# Altium schematic sheet MCU.SchDoc
size A3; SheetNumber: 1; SheetTotal: 3
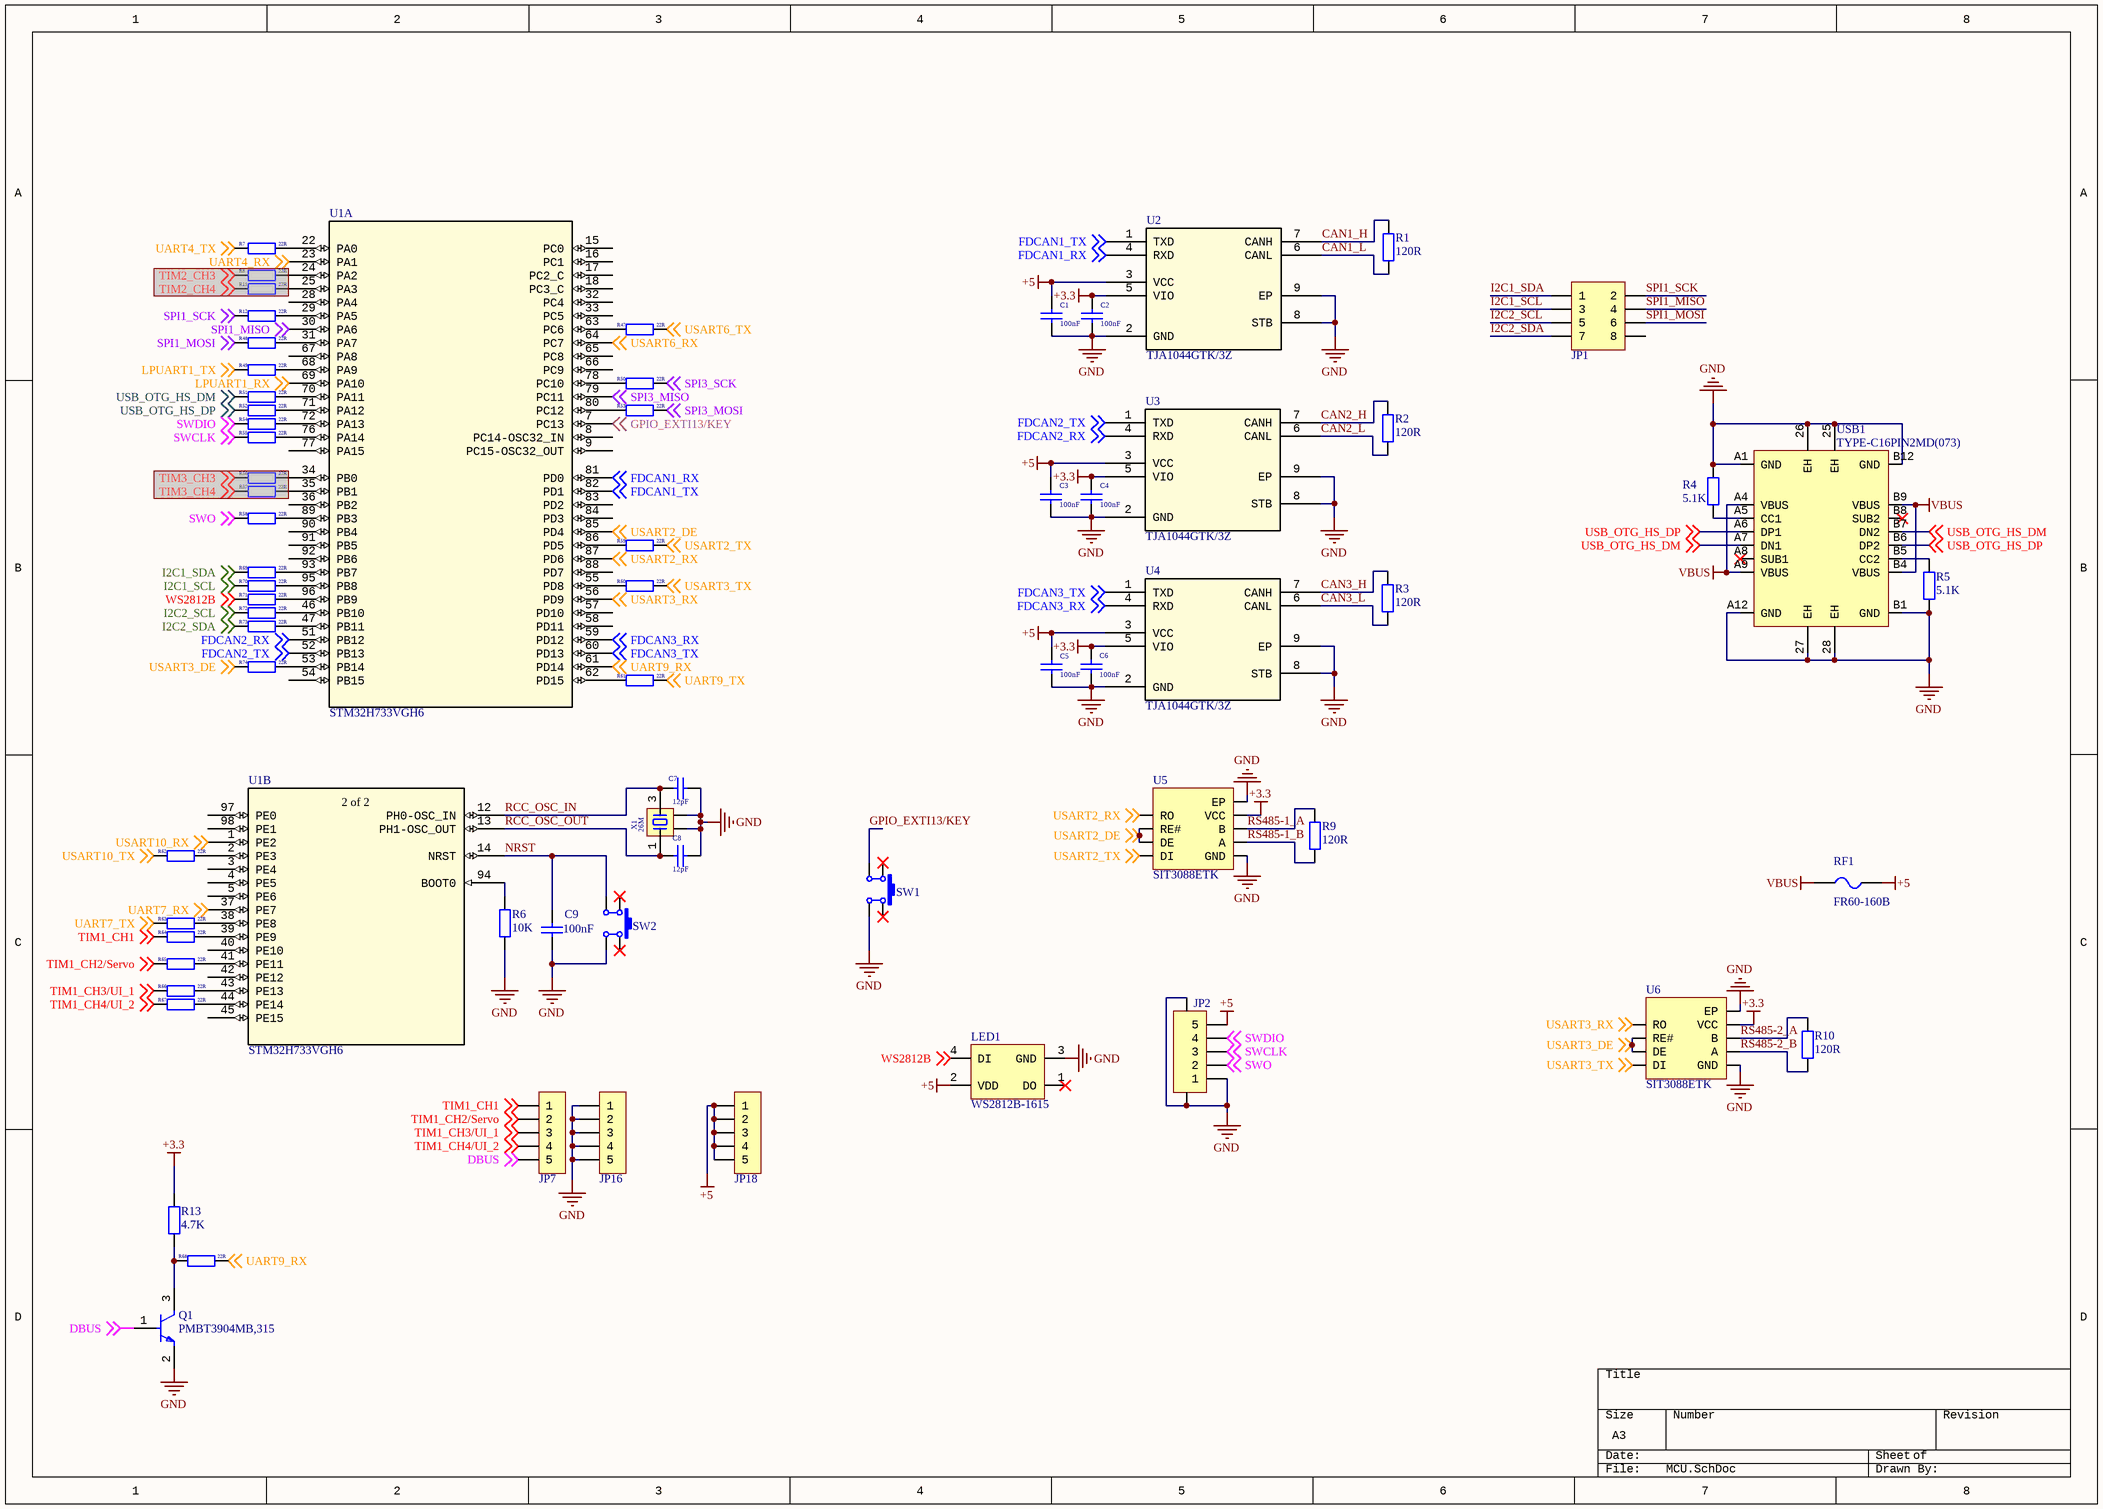
[diagram p0: MCU.SchDoc]

## Parts
C1  100nF  [C0402_L]
C2  100nF  [C0402_L]
C3  100nF  [C0402_L]
C4  100nF  [C0402_L]
C5  100nF  [C0402_L]
C6  100nF  [C0402_L]
C7  12pF  [C0402_L]
C8  12pF  [C0402_L]
C9  100nF  [C0402_L]
JP1  Header 4X2  [IDC2.54-LI-2x4P]  (value not drawn)
JP2  CON-5P  [SH1.0-WT-5P]  (value not drawn)
JP7  HDR-1X5  [HDR2.54-LI-5P]  (value not drawn)
JP16  HDR-1X5  [HDR2.54-LI-5P]  (value not drawn)
JP18  HDR-1X5  [HDR2.54-LI-5P]  (value not drawn)
LED1  WS2812B-1615  [XL-1615RGBC-WS2812B]
Q1  PMBT3904MB,315  [FP-SOT883B-MFG]
R1  120R  [R0402_M]
R2  120R  [R0402_M]
R3  120R  [R0402_M]
R4  5.1K  [R0402_M]
R5  5.1K  [R0402_M]
R6  10K  [R0402_M]
R7  22R  [R0402_M]
R8  22R  [R0402_M]  (masked out: inside a compile mask, not in the netlist)
R9  120R  [R0402_M]
R10  120R  [R0402_M]
R11  22R  [R0402_M]  (masked out: inside a compile mask, not in the netlist)
R12  22R  [R0402_M]
R13  4.7K  [R0402_M]
R47  22R  [R0402_M]
R48  22R  [R0402_M]
R49  22R  [R0402_M]
R50  22R  [R0402_M]
R51  22R  [R0402_M]
R52  22R  [R0402_M]
R53  22R  [R0402_M]
R54  22R  [R0402_M]
R55  22R  [R0402_M]
R56  22R  [R0402_M]  (masked out: inside a compile mask, not in the netlist)
R57  22R  [R0402_M]  (masked out: inside a compile mask, not in the netlist)
R58  22R  [R0402_M]
R59  22R  [R0402_M]
R60  22R  [R0402_M]
R61  22R  [R0402_M]
R62  22R  [R0402_M]
R63  22R  [R0402_M]
R64  22R  [R0402_M]
R65  22R  [R0402_M]
R66  22R  [R0402_M]
R67  22R  [R0402_M]
R68  22R  [R0402_M]
R69  22R  [R0402_M]
R70  22R  [R0402_M]
R71  22R  [R0402_M]
R72  22R  [R0402_M]
R73  22R  [R0402_M]
R74  22R  [R0402_M]
RF1  FR60-160B  [F0603]
SW1  TD-1187SA-250  [SW-SMD-3.5*3.0_4P]  (value not drawn)
SW2  TD-1187SA-250  [SW-SMD-3.5*3.0_4P]  (value not drawn)
U1  STM32H733VGH6  [LQFP100_STM]  (parts A,B of 3)
U2  TJA1044GTK/3Z  [SON8_TJA1044GTK3Z_NXP-L]
U3  TJA1044GTK/3Z  [SON8_TJA1044GTK3Z_NXP-L]
U4  TJA1044GTK/3Z  [SON8_TJA1044GTK3Z_NXP-L]
U5  SIT3088ETK  [DFN-8_L3.0-W3.0-P0.65-BL-EP]
U6  SIT3088ETK  [DFN-8_L3.0-W3.0-P0.65-BL-EP]
USB1  TYPE-C16PIN2MD(073)  [USB-C-SMD_SHOU_TYPE-C-16P-CB1.6]
X1  26M  [XTAL-3225-4P]

## Nets
+3.3: C2.1 C4.1 C6.1 R13.1 U2.5(VIO) U3.5(VIO) U4.5(VIO) U5.8(VCC) U6.8(VCC)
+5: C1.1 C3.1 C5.1 JP2.5 JP18.1 JP18.2 JP18.3 JP18.4 JP18.5 LED1.2(VDD) RF1.1 U2.3(VCC) U3.3(VCC) U4.3(VCC)
GND: C1.2 C2.2 C3.2 C4.2 C5.2 C6.2 C7.2 C8.2 C9.2 JP2.0 JP2.1 JP16.1 JP16.2 JP16.3 JP16.4 JP16.5 LED1.3(GND) Q1.2(E) R4.2 R5.2 R6.1 SW1.3 SW2.3 U2.2(GND) U2.8(STB) U2.9(EP) U3.2(GND) U3.8(STB) U3.9(EP) U4.2(GND) U4.8(STB) U4.9(EP) U5.5(GND) U5.9(EP) U6.5(GND) U6.9(EP) USB1.25(EH) USB1.26(EH) USB1.27(EH) USB1.28(EH) USB1.A1(GND) USB1.A12(GND) USB1.B1(GND) USB1.B12(GND) X1.2 X1.4
VBUS: RF1.2 USB1.A4(VBUS) USB1.A9(VBUS) USB1.B4(VBUS) USB1.B9(VBUS)
CAN1_H: R1.2 U2.7(CANH)
CAN1_L: R1.1 U2.6(CANL)
CAN2_H: R2.2 U3.7(CANH)
CAN2_L: R2.1 U3.6(CANL)
CAN3_H: R3.2 U4.7(CANH)
CAN3_L: R3.1 U4.6(CANL)
DBUS: JP7.5 Q1.1(B) ; off-sheet DBUS
FDCAN1_RX: U1.81(PD0) U2.4(RXD) ; off-sheet FDCAN1_RX
FDCAN1_TX: U1.82(PD1) U2.1(TXD) ; off-sheet FDCAN1_TX
FDCAN2_RX: U1.51(PB12) U3.4(RXD) ; off-sheet FDCAN2_RX
FDCAN2_TX: U1.52(PB13) U3.1(TXD) ; off-sheet FDCAN2_TX
FDCAN3_RX: U1.59(PD12) U4.4(RXD) ; off-sheet FDCAN3_RX
FDCAN3_TX: U1.60(PD13) U4.1(TXD) ; off-sheet FDCAN3_TX
GPIO_EXTI13/KEY: SW1.4 U1.7(PC13) ; off-sheet GPIO_EXTI13/KEY
I2C1_SCL: JP1.3 R70.2 ; off-sheet I2C1_SCL
I2C1_SDA: JP1.1 R69.2 ; off-sheet I2C1_SDA
I2C2_SCL: JP1.5 R72.2 ; off-sheet I2C2_SCL
I2C2_SDA: JP1.7 R73.2 ; off-sheet I2C2_SDA
LPUART1_RX: U1.69(PA10) ; off-sheet LPUART1_RX
LPUART1_TX: R49.2 ; off-sheet LPUART1_TX
NRST: C9.1 SW2.4 U1.14(NRST)
RCC_OSC_IN: C7.1 U1.12(PH0-OSC_IN) X1.3
RCC_OSC_OUT: C8.1 U1.13(PH1-OSC_OUT) X1.1
RS485-1_A: R9.2 U5.7(B)
RS485-1_B: R9.1 U5.6(A)
RS485-2_A: R10.2 U6.7(B)
RS485-2_B: R10.1 U6.6(A)
SPI1_MISO: JP1.4 U1.30(PA6) ; off-sheet SPI1_MISO
SPI1_MOSI: JP1.6 R48.2 ; off-sheet SPI1_MOSI
SPI1_SCK: JP1.2 R12.2 ; off-sheet SPI1_SCK
SPI3_MISO: U1.79(PC11) ; off-sheet SPI3_MISO
SPI3_MOSI: R53.1 ; off-sheet SPI3_MOSI
SPI3_SCK: R50.1 ; off-sheet SPI3_SCK
SWCLK: JP2.3 R55.2 ; off-sheet SWCLK
SWDIO: JP2.4 R54.2 ; off-sheet SWDIO
SWO: JP2.2 R58.2 ; off-sheet SWO
TIM1_CH1: JP7.1 R64.2 ; off-sheet TIM1_CH1
TIM1_CH2/Servo: JP7.2 R65.2 ; off-sheet TIM1_CH2/Servo
TIM1_CH3/UI_1: JP7.3 R66.2 ; off-sheet TIM1_CH3/UI_1
TIM1_CH4/UI_2: JP7.4 R67.2 ; off-sheet TIM1_CH4/UI_2
UART4_RX: U1.23(PA1) ; off-sheet UART4_RX
UART4_TX: R7.2 ; off-sheet UART4_TX
UART7_RX: U1.37(PE7) ; off-sheet UART7_RX
UART7_TX: R63.2 ; off-sheet UART7_TX
UART9_RX: R68.1 U1.61(PD14) ; off-sheet UART9_RX
UART9_TX: R61.1 ; off-sheet UART9_TX
USART2_DE: U1.85(PD4) U5.2(RE#) U5.3(DE) ; off-sheet USART2_DE
USART2_RX: U1.87(PD6) U5.1(RO) ; off-sheet USART2_RX
USART2_TX: R59.1 U5.4(DI) ; off-sheet USART2_TX
USART3_DE: R74.2 U6.2(RE#) U6.3(DE) ; off-sheet USART3_DE
USART3_RX: U1.56(PD9) U6.1(RO) ; off-sheet USART3_RX
USART3_TX: R60.1 U6.4(DI) ; off-sheet USART3_TX
USART6_RX: U1.64(PC7) ; off-sheet USART6_RX
USART6_TX: R47.1 ; off-sheet USART6_TX
USART10_RX: U1.1(PE2) ; off-sheet USART10_RX
USART10_TX: R62.2 ; off-sheet USART10_TX
USB_OTG_HS_DM: R51.2 USB1.A7(DN1) USB1.B7(DN2) ; off-sheet USB_OTG_HS_DM
USB_OTG_HS_DP: R52.2 USB1.A6(DP1) USB1.B6(DP2) ; off-sheet USB_OTG_HS_DP
WS2812B: LED1.4(DI) R71.2 ; off-sheet WS2812B
NetQ1_3: Q1.3(C) R13.2 R68.2
NetR4_1: R4.1 USB1.A5(CC1)
NetR5_1: R5.1 USB1.B5(CC2)
NetR6_2: R6.2 U1.94(BOOT0)
NetR7_1: R7.1 U1.22(PA0)
NetR12_1: R12.1 U1.29(PA5)
NetR47_2: R47.2 U1.63(PC6)
NetR48_1: R48.1 U1.31(PA7)
NetR49_1: R49.1 U1.68(PA9)
NetR50_2: R50.2 U1.78(PC10)
NetR51_1: R51.1 U1.70(PA11)
NetR52_1: R52.1 U1.71(PA12)
NetR53_2: R53.2 U1.80(PC12)
NetR54_1: R54.1 U1.72(PA13)
NetR55_1: R55.1 U1.76(PA14)
NetR58_1: R58.1 U1.89(PB3)
NetR59_2: R59.2 U1.86(PD5)
NetR60_2: R60.2 U1.55(PD8)
NetR61_2: R61.2 U1.62(PD15)
NetR62_1: R62.1 U1.2(PE3)
NetR63_1: R63.1 U1.38(PE8)
NetR64_1: R64.1 U1.39(PE9)
NetR65_1: R65.1 U1.41(PE11)
NetR66_1: R66.1 U1.43(PE13)
NetR67_1: R67.1 U1.44(PE14)
NetR69_1: R69.1 U1.93(PB7)
NetR70_1: R70.1 U1.95(PB8)
NetR71_1: R71.1 U1.96(PB9)
NetR72_1: R72.1 U1.46(PB10)
NetR73_1: R73.1 U1.47(PB11)
NetR74_1: R74.1 U1.53(PB14)

Not connected (* = marked no-connect by the designer): JP1 8; LED1 1(DO)*; SW1 1* 2*; SW2 1* 2*; U1 3(PE4) 4(PE5) 5(PE6) 8(PC14-OSC32_IN) 9(PC15-OSC32_OUT) 15(PC0) 16(PC1) 17(PC2_C) 18(PC3_C) 24(PA2) 25(PA3) 28(PA4) 32(PC4) 33(PC5) 34(PB0) 35(PB1) 36(PB2) 40(PE10) 42(PE12) 45(PE15) 54(PB15) 57(PD10) 58(PD11) 65(PC8) 66(PC9) 67(PA8) 77(PA15) 83(PD2) 84(PD3) 88(PD7) 90(PB4) 91(PB5) 92(PB6) 97(PE0) 98(PE1); USB1 A8(SUB1)* B8(SUB2)*

## Notes on the sheet
- (in symbol CMP-00027-1, part B) 2 of 2

## Library data of the parts
C1-C9 = C: 贴片电容/MLCC电容; BOM名称: 无极性贴片电容; 当前库版本V2023.5.31 @淘宝卖家:黄晶宝石: 最新版本发布https://item.taobao.com/item.htm?id=566775463719
JP1 = Header 4X2: 4*2P接插件; 联系卖家，免费查找封装: 唯一出售店铺网址https://shop463601444.taobao.com; 封装库来自淘宝卖家ID：黄晶宝石: 其他店铺购入均为盗版封装库，请立即申请退款，本店现金奖励50~200元; BOM名称: 4*2P接插件
JP2 = Header 5: 5P连接器; 封装库来自淘宝卖家：黄晶宝石: 获取最新版本https://shop463601444.taobao.com; BOM名称: 5P连接器
JP7 JP16 JP18 = Header 5: 5P接插件; 联系卖家，免费查找封装: 唯一出售店铺网址https://shop463601444.taobao.com; 封装库来自淘宝卖家ID：黄晶宝石: 其他店铺购入均为盗版封装库，请立即申请退款，本店现金奖励50~200元; BOM名称: 5P接插件
LED1 = CMP-00052-1: LED幻彩灯珠
Q1 = CMP-14406-000022-1: TRANS NPN 40V 0.2A 3DFN
R1-R12 R47-R74 = R: 贴片电阻; 联系下单店铺卖家 免费帮你查找封装: 联系下单店铺卖家 免费技术支持; BOM名称: 贴片电阻
R13 = CMP-005-000000-1: 贴片电阻; 联系下单店铺卖家 免费帮你查找封装: 联系下单店铺卖家 免费技术支持; BOM名称: 贴片电阻; Source: 0.1 - 电阻-电容-电感-保险丝-晶振-晶体-磁珠-电位器-法拉电容-馈通电容.SchLib; Design Item ID: R
RF1 = FUSE-PPTC: PPTC自恢复保险丝; 当前库版本V2023.5.31 @淘宝卖家:黄晶宝石: 最新版本发布https://item.taobao.com/item.htm?id=566775463719; BOM名称: PPTC自恢复保险丝
SW1 SW2 = TD-1187SA-250: 小乌龟-侧按4脚开关 带定位柱; 联系下单店铺卖家 免费技术支持: 联系下单店铺卖家 免费帮你查找封装
U1 = CMP-00027-1: High-performance and DSP with DP-FPU, Arm Cortex-M7 MCU with 1 MByte Flash, 564 Kbytes RAM, 550 MHz CPU, L1 cache,...
U2-U4 = CMP-00028-4: CAN High Speed Transceiver 1Mbps Normal/Standby 4.75V to 5.25V 8-Pin HVSON T/R
U5 U6 = CMP-00068-2
USB1 = CMP-00067-1
X1 = XTAL-4P: 4脚无源晶振(谐振器）; 联系下单店铺卖家 免费帮你查找封装: 联系下单店铺卖家 免费技术支持; BOM名称: 4脚无源晶振(谐振器）